# EAGLE design PocketChipBrd (EAGLE 8.1.0)
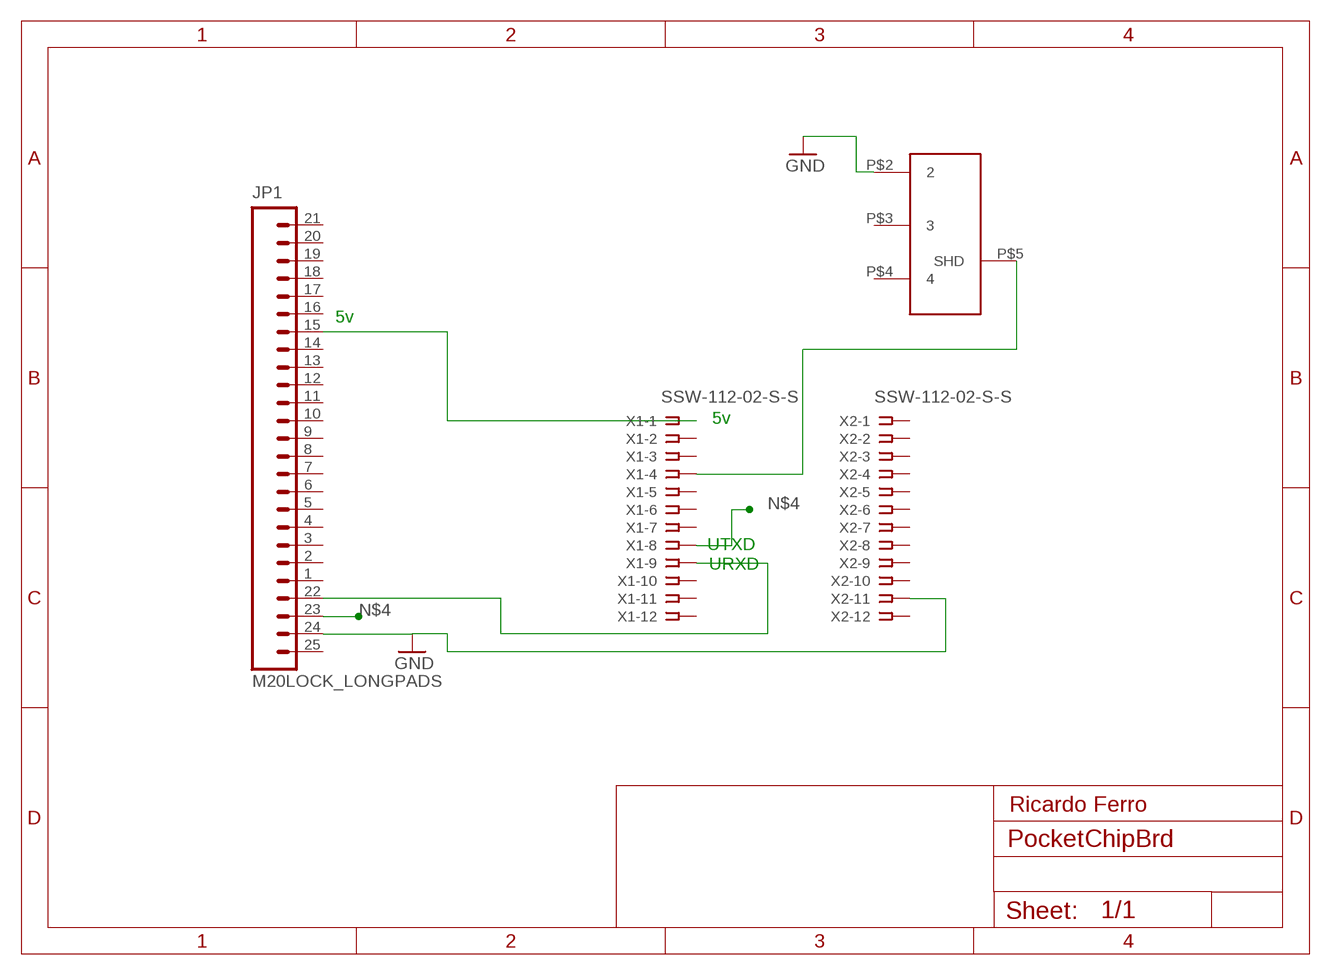
[diagram p0: schematic, sheet 1]

## Parts
JP1  M20LOCK_LONGPADS  [1X20_LOCK_LONGPADS]
U$1  PJ-320D  [PJ-320D]
X1  SSW-112-02-S-S  [SSW-112-02-S-S]
X2  SSW-112-02-S-S  [SSW-112-02-S-S]

## Nets
GND: JP1.24 U$1.P$2 X2.11
N$1: JP1.15 X1.1
N$2: U$1.P$5(SHD) X1.4
N$3: JP1.22 X1.9
N$4: JP1.23 X1.8
Unconnected: JP1.1 JP1.2 JP1.3 JP1.4 JP1.5 JP1.6 JP1.7 JP1.8 JP1.9 JP1.10 JP1.11 JP1.12 JP1.13 JP1.14 JP1.16 JP1.17 JP1.18 JP1.19 JP1.20 JP1.21 JP1.25 U$1.P$3 U$1.P$4 X1.2 X1.3 X1.5 X1.6 X1.7 X1.10 X1.11 X1.12 X2.1 X2.2 X2.3 X2.4 X2.5 X2.6 X2.7 X2.8 X2.9 X2.10 X2.12

## Notes on the sheet
- 5v
- 5v
- UTXD
- URXD
- Ricardo Ferro

## Library data of the parts
JP1 = PocketCHIP-v1.0:M20: 1x20 .1" header This is just like the LOCK variant in that the holes are staggared by 5 mil, but except for the last two holes. They are not altered from the "standard" footprint layout. This is used for a special purpose on the layout of our Graphic LCD Backpack. Make sure you want to use this device before selecting it for you project!
U$1 = lpatiny:PJ-320D: SMD headphones Jack PJ-320D
X1 X2 = con-samtec:SSW-112-02-S-S: THROUGH-HOLE .025" SQ POST SOCKET Source: Samtec SSW.pdf; MPN: SSW-112-02-S-S; OC_FARNELL: unknown; OC_NEWARK: 11P9515

## Board
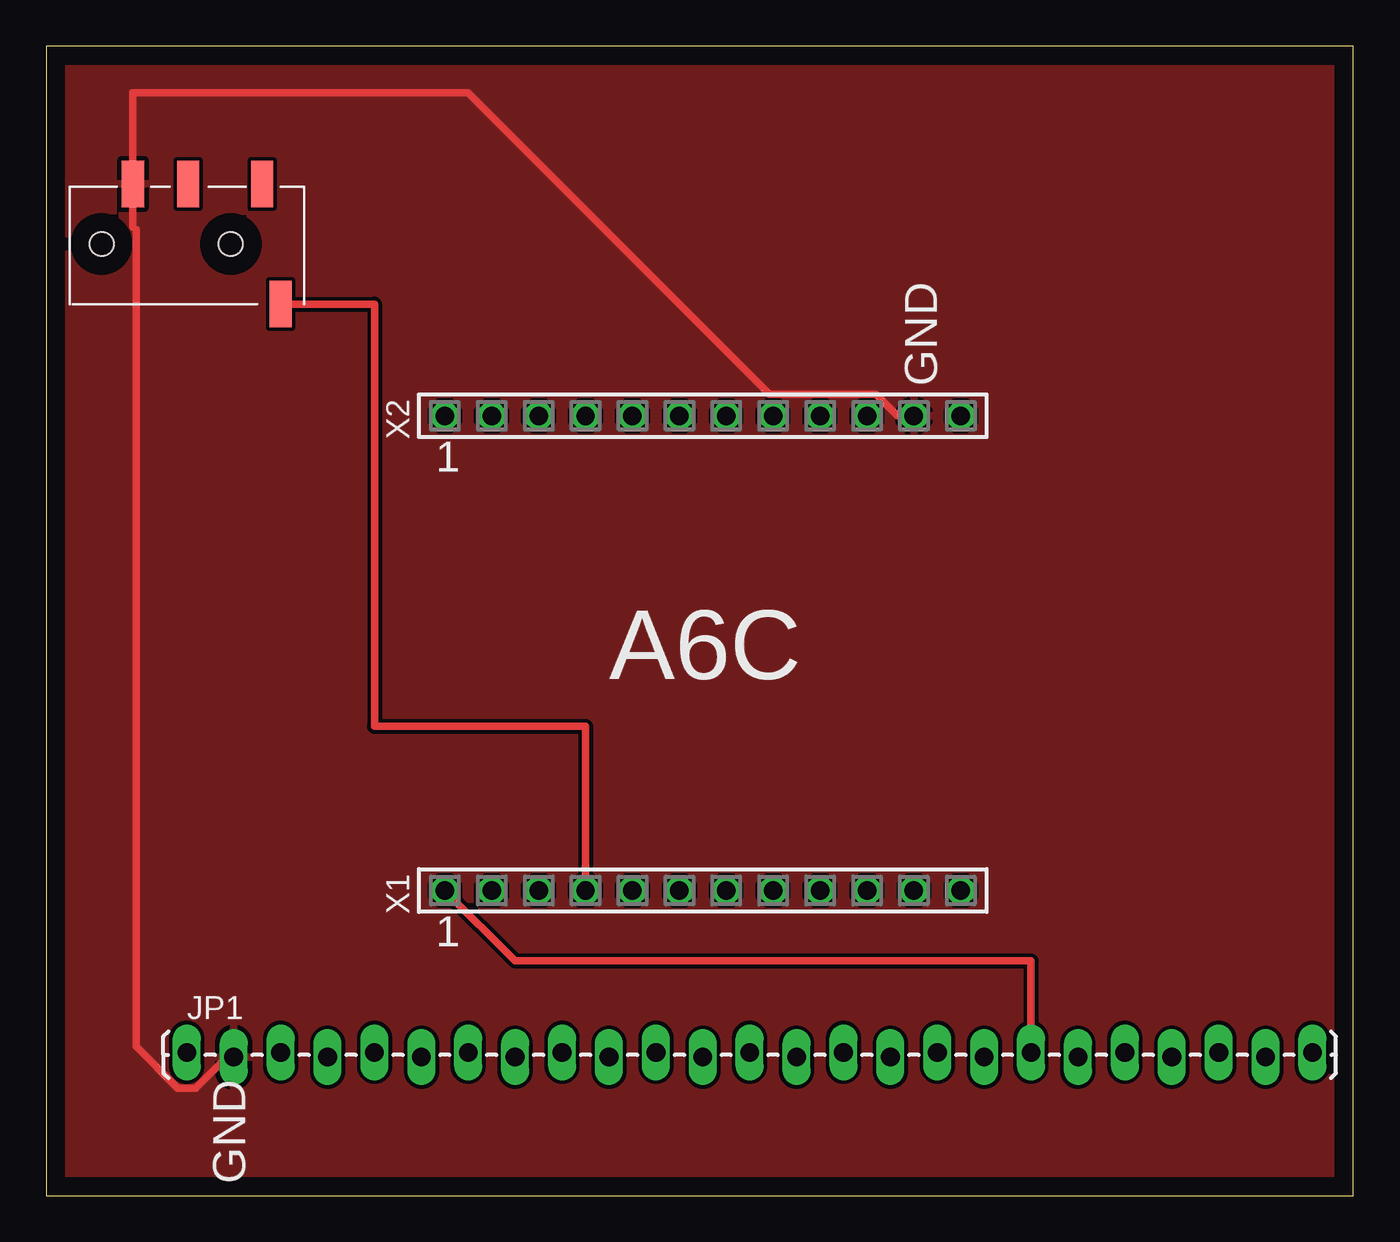
[diagram p1: board, top side]
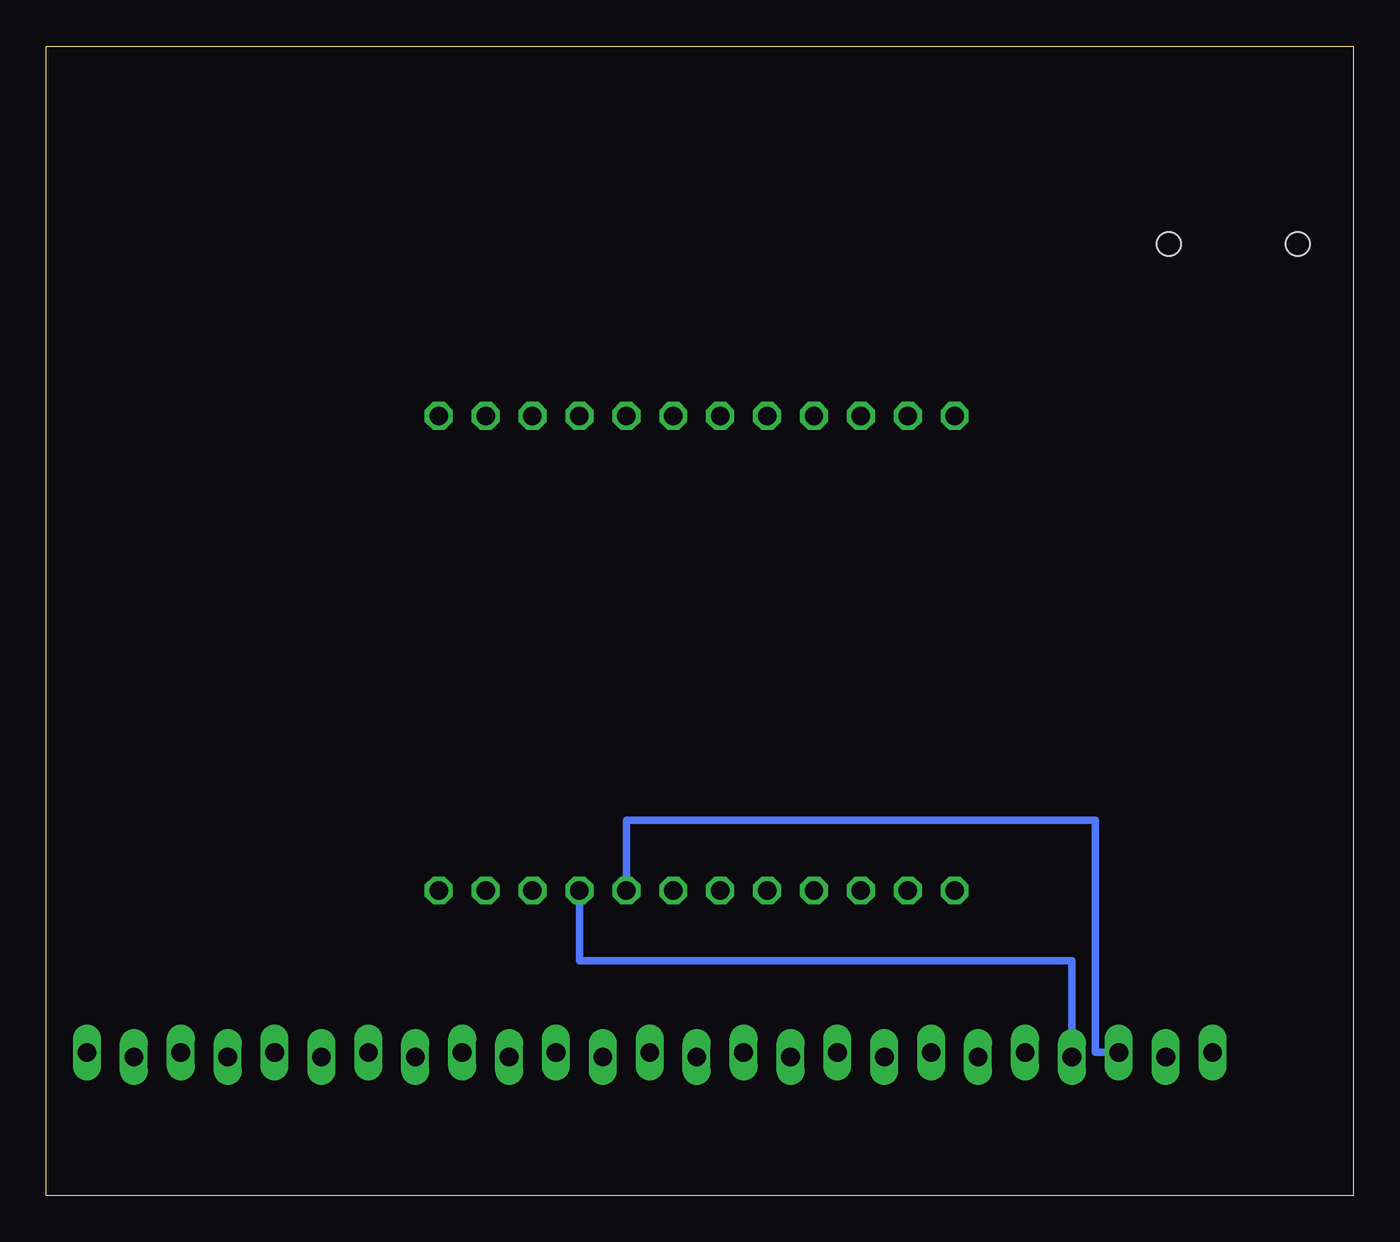
[diagram p2: board, bottom side, seen from below]

Size 70.79 x 62.22 mm. Coordinates in mm from the lower left corner, seen from the top.
Outline: 0,0 70.79,0 70.79,62.22 0,62.22 0,0
Copper layers (1*16): Top 0.035mm / dielectric 1.5mm / Bottom 0.035mm
Design rules "default": minimum track width 10mil, minimum drill 24mil, track to track 8mil, track to pad 8mil, pad to pad 8mil, via to via 8mil, smd to smd 8mil, copper to edge 40mil, drill to drill 8mil, minimum pad ring 10mil, minimum via ring 8mil, stop-mask expansion 4mil, vias tented up to drill 0mil, thermal gap 10mil

### Footprints (pad centres in the part's own frame; a part is rotated, then mirrored left to right if it is on the bottom)
1X20_LOCK_LONGPADS = drill 1.016 long: 1 0,0.127; 2 2.54,-0.127; 3 5.08,0.127; 4 7.62,-0.127; 5 10.16,0.127; 6 12.7,-0.127; 7 15.24,0.127; 8 17.78,-0.127; 9 20.32,0.127; 10 22.86,-0.127; 11 25.4,0.127; 12 27.94,-0.127; 13 30.48,0.127; 14 33.02,-0.127; 15 35.56,0.127; 16 38.1,-0.127; 17 40.64,0.127; 18 43.18,-0.127; 19 45.72,0.127; 20 48.26,-0.127; 21 50.8,0.127; 22 -2.54,-0.127; 23 -5.08,0.127; 24 -7.62,-0.127; 25 -10.16,0.127
PJ-320D = smd 2.5 x 1.2: P$2 6.5,8; P$3 6.5,5; P$4 6.5,1; P$5 0,0 | hole 1.3: 3.25,9.7; 3.25,2.7
SSW-112-02-S-S = drill 1 pad 1.5 octagon: 1 -13.97,0; 2 -11.43,0; 3 -8.89,0; 4 -6.35,0; 5 -3.81,0; 6 -1.27,0; 7 1.27,0; 8 3.81,0; 9 6.35,0; 10 8.89,0; 11 11.43,0; 12 13.97,0

### Placement (x,y rotation side)
JP1  17.78,7.62 0 top
U$1  12.7,48.26 90 top
X1  35.56,16.51 0 top
X2  35.56,42.21 0 top

### Tracks (layer width: path | path; a pad name or v marks a point on that pad's centre or on a via)
GND
  Top 0.406: X2.11 46.09,42.21 44.93,43.37 39.18,43.37 22.86,59.69 4.7,59.69 U$1.P$2 4.7,52.45 4.87,52.28 4.87,8.08 7.14,5.82 8.1,5.82 9.78,7.49 JP1.24
  pour Top: -8.89,66.04 -10.16,-3.81 78.74,-5.08 78.74,67.31
N$1
  Top 0.406: X1.1 25.4,12.7 53.34,12.7 JP1.15
N$2
  Top 0.406: U$1.P$5 17.78,48.26 17.78,25.4 29.21,25.4 X1.4
N$3
  Bottom 0.406: JP1.22 15.24,12.7 41.91,12.7 X1.9
N$4
  Bottom 0.406: JP1.23 13.97,7.75 13.97,20.32 39.37,20.32 X1.8

### Text on the board
tPlace: GND | A6C | GND